# Altium schematic sheet Schematics.schdoc
size 307 x 191 mm
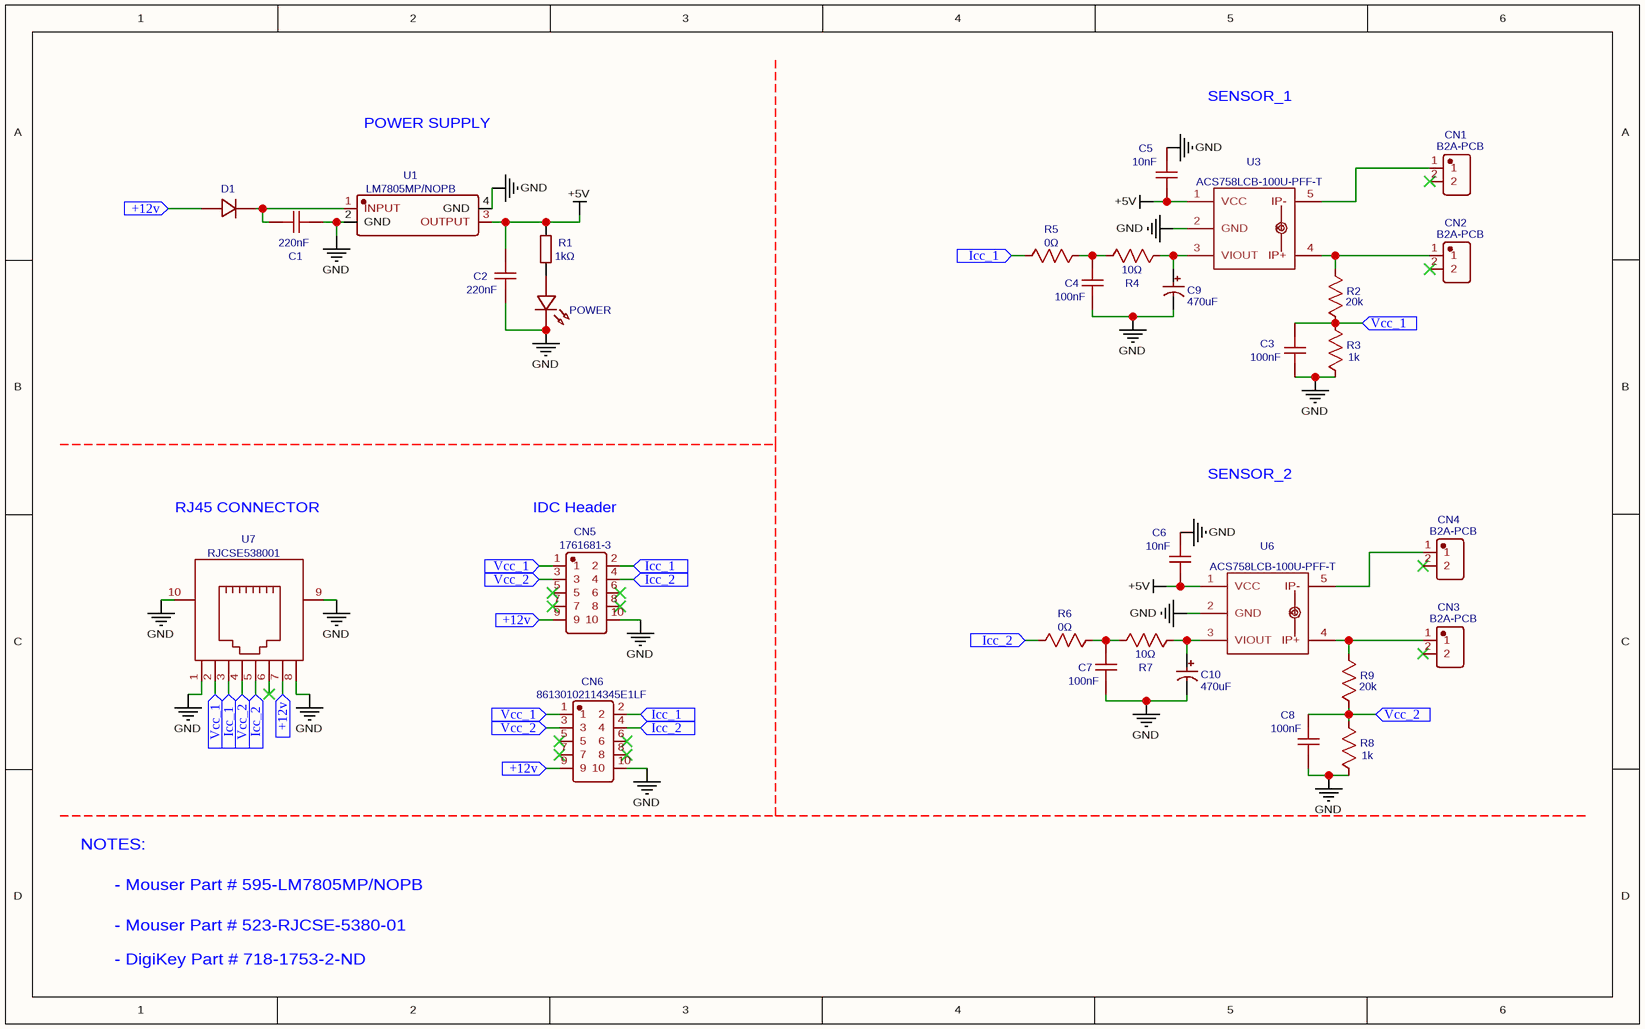
[diagram p0: Schematics.schdoc]

## Parts
C1  220nF  [C0805]
C2  220nF  [C0805]
C3  100nF  [C0805]
C4  100nF  [C0805]
C5  10nF  [C0805]
C6  10nF  [C0805]
C7  100nF  [C0805]
C8  100nF  [C0805]
C9  470uF  [CASE-D_7343]
C10  470uF  [CASE-D_7343]
CN1  B2A-PCB  [CONN-TH_B2A-PCB]
CN2  B2A-PCB  [CONN-TH_B2A-PCB]
CN3  B2A-PCB  [CONN-TH_B2A-PCB]
CN4  B2A-PCB  [CONN-TH_B2A-PCB]
CN5  1761681-3  [CONN-TH_10P-P2.54_TE_1761681-3]
CN6  86130102114345E1LF  [IDC-TH_10P-P2.54_86130102114345E1LF]
D1  CD4148WSP-C109001  [D0805-RD]  (value not drawn)
POWER  LED-0805_G  [LED0805_GREEN]  (value not drawn)
R1  1kΩ  [R0805]
R2  20k  [R0805]
R3  1k  [R0805]
R4  10Ω  [R0805]
R5  0Ω  [R0805]
R6  0Ω  [R0805]
R7  10Ω  [R0805]
R8  1k  [R0805]
R9  20k  [R0805]
U1  LM7805MP/NOPB  [SOT-223-4_L6.5-W3.5-P2.30-LS7.0-BR]
U3  ACS758LCB-100U-PFF-T  [SENSOR-TH_ACS758LCB-100B-PFF-T]
U6  ACS758LCB-100U-PFF-T  [SENSOR-TH_ACS758LCB-100B-PFF-T]
U7  RJCSE538001  [RJ45-SMD_RJCSE538001]

## Ports
+12v (in), Icc_1 (in), Icc_2 (in), Vcc_1 (in), Vcc_2 (in)

## Nets
+5V: C2.1 C5.2 C6.2 R1.2 U1.3(OUTPUT) U3.1(VCC) U6.1(VCC)
GND: C1.2 C2.2 C3.2 C4.2 C5.1 C6.1 C7.2 C8.2 C9.2 C10.2 CN5.10 CN6.10 POWER.2 R3.1 R8.1 U1.2(GND) U1.4(GND) U3.2(GND) U6.2(GND) U7.1 U7.8 U7.9(EH) U7.10(EH)
+12v: CN5.9 CN6.9 D1.2 U7.7 ; port +12v
Icc_1: CN5.2 CN6.2 R5.2 U7.3 ; port Icc_1
Icc_2: CN5.4 CN6.4 R6.2 U7.5 ; port Icc_2
Vcc_1: C3.1 CN5.1 CN6.1 R2.1 R3.2 U7.2 ; port Vcc_1
Vcc_2: C8.1 CN5.3 CN6.3 R8.2 R9.1 U7.4 ; port Vcc_2
NetC1_1: C1.1 D1.1 U1.1(INPUT)
NetC4_1: C4.1 R4.2 R5.1
NetC7_1: C7.1 R6.1 R7.2
NetC9_1: C9.1 R4.1 U3.3(VIOUT)
NetC10_1: C10.1 R7.1 U6.3(VIOUT)
NetCN1_1: CN1.1 U3.5(IP-)
NetCN2_1: CN2.1 R2.2 U3.4(IP+)
NetCN3_1: CN3.1 R9.2 U6.4(IP+)
NetCN4_1: CN4.1 U6.5(IP-)
NetPOWER_1: POWER.1 R1.1

Not connected (* = marked no-connect by the designer): CN1 2*; CN2 2*; CN3 2*; CN4 2*; CN5 5* 6* 7* 8*; CN6 5* 6* 7* 8*; U7 6*

## Notes on the sheet
- SENSOR_1
- POWER SUPPLY
- RJ45 CONNECTOR
- (near CN5) IDC Header
- SENSOR_2
- NOTES:
- - Mouser Part # 595-LM7805MP/NOPB
- - Mouser Part # 523-RJCSE-5380-01
- - DigiKey Part # 718-1753-2-ND

## Library data of the parts
C1 C2 = 220nF: nameAlias: Value(F); Contributor: LCEDA_Lib; spicePre: C; spiceSymbolName: C_0805_US
C3 C4 C7 C8 = 100nF: nameAlias: Value(F); Contributor: LCEDA_Lib; spicePre: C; spiceSymbolName: C_0805_US
C5 C6 = 10nF: nameAlias: Value(F); Contributor: LCEDA_Lib; spicePre: C; spiceSymbolName: C_0805_US
C9 C10 = 470uF: Manufacturer: VISHAY(威世); Manufacturer Part: 293D477X9010E2TE3; nameAlias: Value; Contributor: LCSC; Supplier: LCSC; Supplier Part: C232200; JLCPCB Part Class: Extended Part; spicePre: C; spiceSymbolName: 293D477X9010E2TE3
CN1-CN4 = B2A-PCB: Manufacturer: null; Contributor: lcsc; Supplier: LCSC; Supplier Part: C9900139726; Manufacturer Part: B2A-PCB; spicePre: C; spiceSymbolName: B2A-PCB
CN5 = 1761681-3: Manufacturer: TE Connectivity(泰科电子); Contributor: LCSC; Supplier: LCSC; Supplier Part: C573025; Manufacturer Part: 1761681-3; JLCPCB Part Class: Extended Part; spicePre: C; spiceSymbolName: 1761681-3
CN6 = 86130102114345E1LF: Manufacturer: Amphenol; Contributor: LCSC; Supplier: LCSC; Supplier Part: C464630; Manufacturer Part: 86130102114345E1LF; JLCPCB Part Class: Extended Part; spicePre: C; spiceSymbolName: 86130102114345E1LF
D1 = CD4148WSP-C109001: Manufacturer: LIZ(丽智电子); Supplier: LCSC; Manufacturer Part: CD4148WSP; Supplier Part: C109001; JLCPCB Part Class: Extended Part; spicePre: D; spiceSymbolName: CD4148WSP-C109001
POWER = LED-0805_G: Manufacturer: 国星光电; Manufacturer Part: NCD0805G1; Contributor: LCEDA_Lib; Supplier Part: C84260; spicePre: L; spiceSymbolName: LED-0805_G
R1 = 1kΩ: Manufacturer: UNI-ROYAL(厚声); Manufacturer Part: 0805W8F1001T5E; nameAlias: Value; Supplier: LCSC; Supplier Part: C17513; JLCPCB Part Class: Basic Part; spicePre: R; spiceSymbolName: 0805W8F1001T5E
R2 R9 = 20k: nameAlias: Value(Ω); Contributor: LCEDA_Lib; spicePre: R; spiceSymbolName: R_0805_US
R3 R8 = 1k: nameAlias: Value(Ω); Contributor: LCEDA_Lib; spicePre: R; spiceSymbolName: R_0805_US
R4 R7 = 10Ω: nameAlias: Value(Ω); Contributor: LCEDA_Lib; spicePre: R; spiceSymbolName: R_0805_US
R5 R6 = 0Ω: nameAlias: Value(Ω); Contributor: LCEDA_Lib; spicePre: R; spiceSymbolName: R_0805_US
U1 = LM7805MP/NOPB: Manufacturer: TI(德州仪器); Contributor: LCSC; Supplier: LCSC; Supplier Part: C2872300; Manufacturer Part: LM7805MP/NOPB; JLCPCB Part Class: Extended Part; spicePre: U; spiceSymbolName: LM7805MP/NOPB
U3 U6 = ACS758LCB-100U-PFF-T: Manufacturer: ALLEGRO(美国埃戈罗); Manufacturer Part: ACS758LCB-100B-PFF-T; Supplier: LCSC; Supplier Part: C82405; JLCPCB Part Class: Extended Part; spicePre: U; spiceSymbolName: ACS758LCB-100B-PFF-T
U7 = RJCSE538001: Manufacturer: Amphenol; Contributor: lcsc; Supplier: LCSC; Supplier Part: C5383710; Manufacturer Part: RJCSE538001; JLCPCB Part Class: Extended Part; spicePre: U; spiceSymbolName: RJCSE538001